# Altium schematic sheet Interface.SchDoc
size A4; SheetNumber: 2; SheetTotal: 2
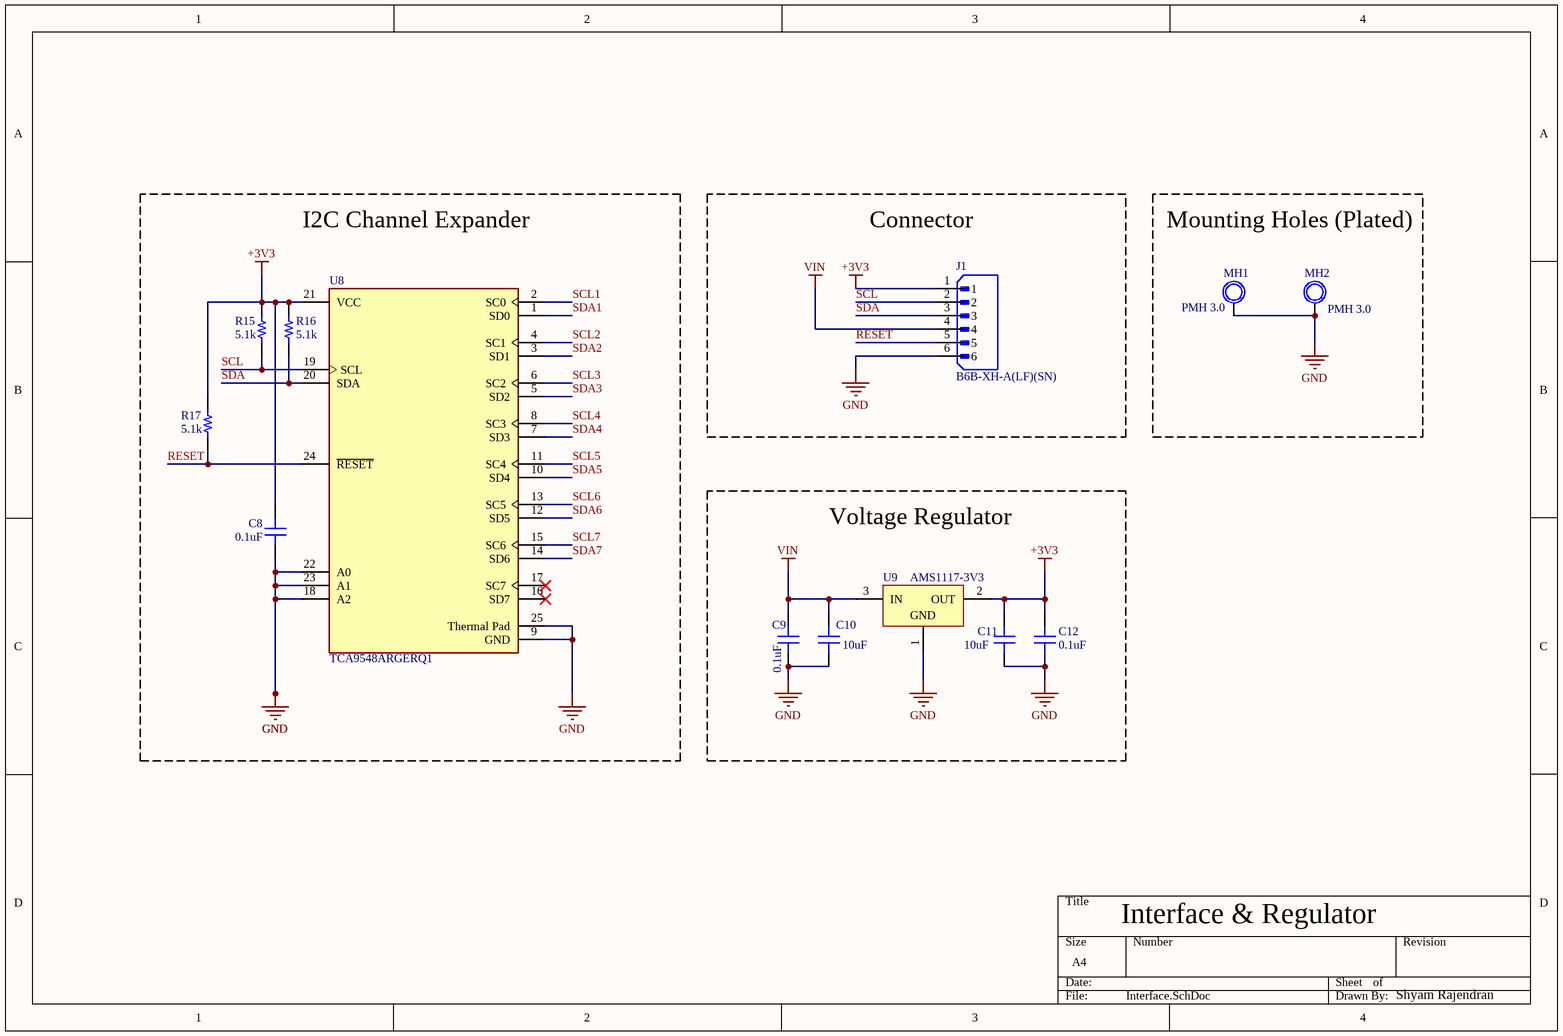
[diagram p0: Interface.SchDoc]

## Parts
C8  Capacitance: 0.1uF  [CAP 0603_1608]  (hidden comment: 10uF)
C9  Capacitance: 0.1uF  [CAP 0603_1608]  (hidden comment: 10uF)
C10  10uF  [CAP 0603_1608]
C11  10uF  [CAP 0603_1608]
C12  Capacitance: 0.1uF  [CAP 0603_1608]  (hidden comment: 10uF)
J1  B6B-XH-A(LF)(SN)  [JST_B6B-XH-A(LF)(SN)]
MH1  PMH 3.0  [NPMH]
MH2  PMH 3.0  [NPMH]
R15  5.1K  [RES 0603_1608]
R16  5.1K  [RES 0603_1608]
R17  5.1K  [RES 0603_1608]
U8  TCA9548ARGERQ1  [TCA9548]
U9  AMS1117-3V3  [AMS1117, 5V]

## Blocks framed on the sheet
I2C Channel Expander: C8 R15-R17 U8
Connector: J1
Mounting Holes (Plated): MH1 MH2
Voltage Regulator: C9-C12 U9

## Nets
+3V3: C8.2 C11.2 C12.2 J1.1 R15.2 R16.2 R17.2 U8.21(VCC) U9.2(OUT)
GND: C8.1 C9.1 C10.1 C11.1 C12.1 J1.6 MH1.GND MH2.GND U8.9(GND) U8.18(A2) U8.22(A0) U8.23(A1) U8.25(Thermal_Pad) U9.1(GND)
VIN: C9.2 C10.2 J1.4 U9.3(IN)
RESET: J1.5 R17.1 U8.24(~{RESET})
SCL: J1.2 R15.1 U8.19(SCL)
SCL1: U8.2(SC0)
SCL2: U8.4(SC1)
SCL3: U8.6(SC2)
SCL4: U8.8(SC3)
SCL5: U8.11(SC4)
SCL6: U8.13(SC5)
SCL7: U8.15(SC6)
SDA: J1.3 R16.1 U8.20(SDA)
SDA1: U8.1(SD0)
SDA2: U8.3(SD1)
SDA3: U8.5(SD2)
SDA4: U8.7(SD3)
SDA5: U8.10(SD4)
SDA6: U8.12(SD5)
SDA7: U8.14(SD6)

Not connected (* = marked no-connect by the designer): U8 16(SD7)* 17(SC7)*

## Notes on the sheet
- Interface & Regulator
- Shyam Rajendran

## Library data of the parts
C8-C12 = GCJ188C70J335KE02D: 0603; manufacturer: Murata Electronics; Temperature Coefficient: X7S; Tolerance: ±10%; value: 3.3 µF; Voltage - Rated: 6.3V; Part Number: GCJ188C70J335KE02D; Applications: Automotive, Boardflex Sensitive; componentlink1description: Datasheet; componentlink1url: https://search.murata.co.jp/Ceramy/image/img/A01X/G101/ENG/GCJ188C70J335KE02-01A.pdf; componentlink2description: DigiKey Link; componentlink2url: https://www.digikey.com/en/products/detail/murata-electronics/GCJ188C70J335KE02D/10696585; Device Package: 0603 (1608 Metric); Features: Soft Termination; lastupdated: 09-02-2024 20:08:53; Lifecycle Status: Active; Minimum Order: 1; Mounting Type: Surface Mount, MLCC; Operating Temperature: -55°C ~ 125°C; Package / Case: 0603 (1608 Metric); packaging: TapeAndReel; partid: 55427; Part Status: Active; price: 0.04; Ratings: AEC-Q200; series: GCJ; Size / Dimension: 0.063" L x 0.031" W (1.60mm x 0.80mm); Supplier 1: DigiKey; Supplier Part Number 1: 490-GCJ188C70J335KE02DCT-ND; Thickness (Max): 0.039" (1.00mm)
  C10 C11: Capacitance: 10uF
J1 = B6B-XH-A(LF)(SN): Connector Header Through Hole 6 position 0.098 (2.50mm); MF: JST Sales; SnapEDA_Link: https://www.snapeda.com/parts/B6B-XH-A(LF)(SN)/JST+Sales+America+Inc./view-part/?ref=snap; Package: None; Value: *; MP: B6B-XH-A(LF)(SN); Check_prices: https://www.snapeda.com/parts/B6B-XH-A(LF)(SN)/JST+Sales+America+Inc./view-part/?ref=eda
MH1 MH2 = PMH: PMH 3.0mm
R15-R17 = RNCS0603BKE10K0: 0603; Manufacturer: Stackpole Electronics Inc; Power (Watts): 0.063W, 1/16W; Resistance: 10 kOhms; Temperature Coefficient: ±25ppm/°C; Tolerance: ±0.1%; Part Number: RNCS0603BKE10K0; Value: 5.1k; ComponentLink1Description: Datasheet; ComponentLink1URL: https://www.seielect.com/catalog/sei-rncs_rnch.pdf; ComponentLink2Description: DigiKey Link; ComponentLink2URL: https://www.digikey.com/en/products/detail/stackpole-electronics-inc/RNCS0603BKE10K0/1708836; Composition: Thin Film; Device Package: 0603 (1608 Metric); Features: Anti-Corrosive, Automotive AEC-Q200, Moisture Resistant; Height - Seated (Max): 0.022" (0.55mm); LastUpdated: 09-02-2024 20:43:37; Lifecycle Status: Active; Minimum Order: 1; Number of Terminations: 2; Operating Temperature: -55°C ~ 155°C; Package / Case: 0603 (1608 Metric); Packaging: TapeAndReel; PartId: 4838; Part Status: Active; Price: 0.06; Ratings: AEC-Q200; Series: RNCS; Size / Dimension: 0.061" L x 0.031" W (1.55mm x 0.80mm); Supplier 1: DigiKey; Supplier Part Number 1: RNCS0603BKE10K0CT-ND; Supplier Device Package: 0603
U8 = TCA9548ARGERQ1: I2C Switch with Reset 8 Channel Bi-Directional 1.65V to 5.25V 24-Pin VQFN Cut Tape; ComponentLink3Description: https://datasheet.ciiva.com:443/pdfs/VipMasterIC/IC/WBND/WBND-S-A0002933800/WBND-S-A0002933800-1.pdf?src-supplier=IHS+Markit; Min Supply Voltage: 1.65V; Max Supply Voltage: 5.25V; RoHS: Compliant; Length: 4mm; ComponentLink2Description: http://www.winbond.com/resource-files/w25q128jv%20spi%20revc%2011162016.pdf?src-supplier=Digikey; Width: 4mm; Min Operating Temperature: -40°C; ComponentLink1Description: http://www.winbond.com/resource-files/w25q128jv%20revf%2003272018%20plus.pdf?src-supplier=Digikey; Pins: 24; Case/Package: VQFN; Max Operating Temperature: 85°C
U9 = AMS1117-3V3: SOT89